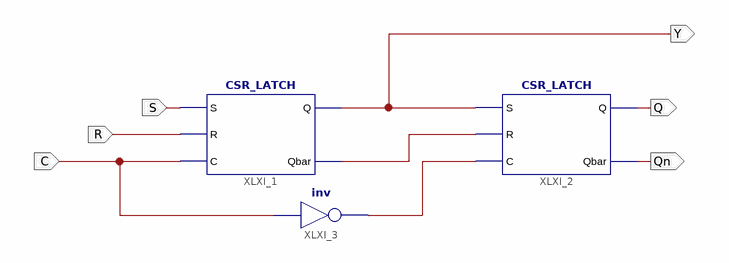
[diagram p0: schematic sheet 1]
// Xilinx ISE schematic MS_FLIPFLOP.sch (kintex7) as structural Verilog: 3 symbols, 6 ports
module MS_FLIPFLOP (
  input  R,
  input  C,
  input  S,
  output Q,
  output Qn,
  output Y
);

  wire XLXN_5, XLXN_10;

  CSR_LATCH XLXI_1 (.S(S), .R(R), .C(C), .Q(Y), .Qbar(XLXN_5));
  CSR_LATCH XLXI_2 (.S(Y), .R(XLXN_5), .C(XLXN_10), .Q(Q), .Qbar(Qn));
  not XLXI_3 (XLXN_10, C);
endmodule
